# Altium project ieevs.PrjPcb
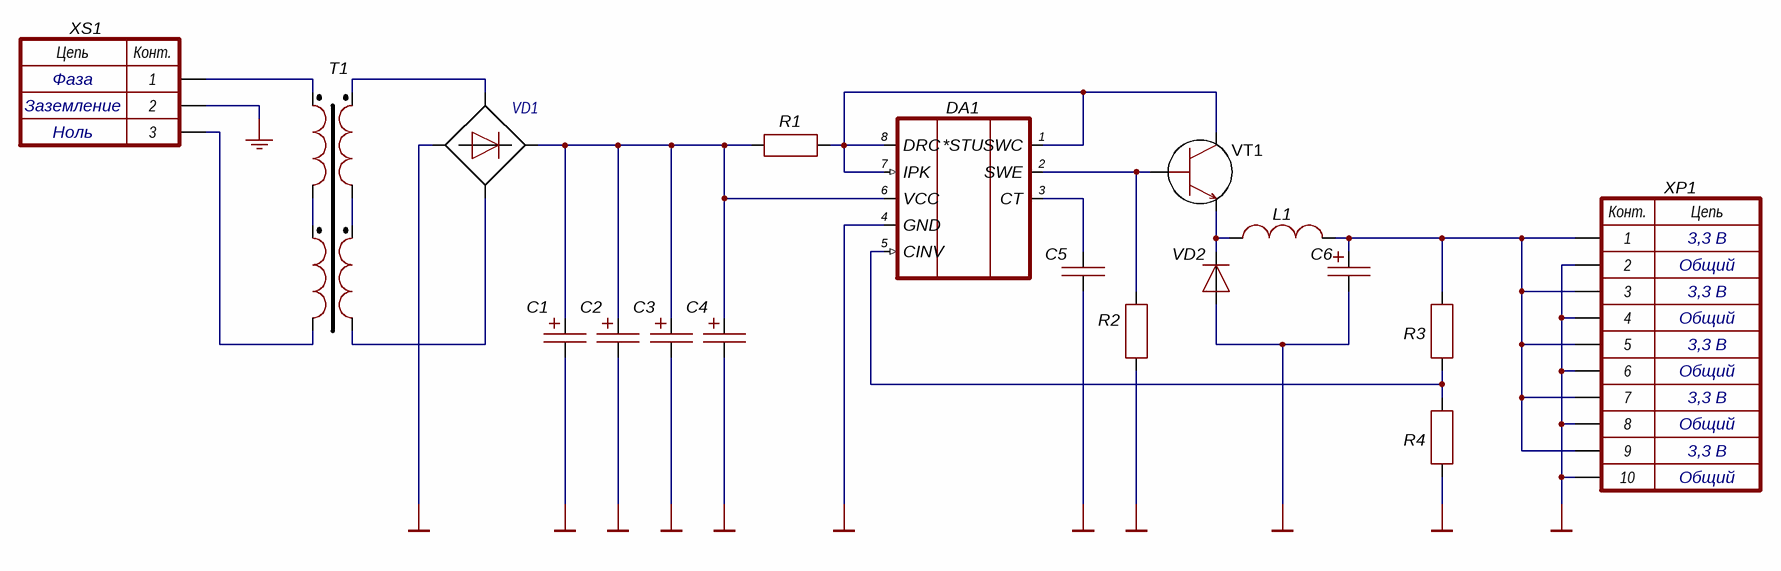
[diagram p0: principal.SchDoc]
1 sheet, 18 parts. Net scope: global (net labels, ports and power ports of the same name join across sheets).

## Sheet principal.SchDoc
size 420 x 297 mm

### Parts
C1  C_POL  [C_SMD_Al_G]  (value not drawn)
C2  C_POL  [C_SMD_Al_G]  (value not drawn)
C3  C_POL  [C_SMD_Al_G]  (value not drawn)
C4  C_POL  [C_SMD_Al_G]  (value not drawn)
C5  C  [C_1206]  (value not drawn)
C6  C_POL  [C_SMD_Al_G]  (value not drawn)
DA1  MC34063  [SO8]  (value not drawn)
L1  L  [IND_HTTI-220-3.0]  (value not drawn)
R1  R  [R_1206]  (value not drawn)
R2  R  [R_1206]  (value not drawn)
R3  R  [R_1206]  (value not drawn)
R4  R  [R_1206]  (value not drawn)
T1  T1-6_12-10  [TRANSFORMER_FS24-1500]  (value not drawn)
VD1  DB201S  [DIOB_DB107S]  (value not drawn)
VD2  VD  [SOD123]  (value not drawn)
VT1  NPN_BEC  [TO229P990X238-3N]  (value not drawn)
XP1  X_10  [PLS-10]  (value not drawn)
XS1  X_3  [PCBComponent_1]  (value not drawn)

### Nets
EARTH: XS1.2
GND: C1.1 C2.1 C3.1 C4.1 C5.1 C6.1 DA1.4(GND) R2.1 R4.1 VD1.NEG(A) VD2.1(A) XP1.2 XP1.4 XP1.6 XP1.8 XP1.10
NetC1_2: C1.2 C2.2 C3.2 C4.2 DA1.6(VCC) R1.2 VD1.POS(C)
NetC5_2: C5.2 DA1.3(CT)
NetC6_2: C6.2 L1.2 R3.2 XP1.1 XP1.3 XP1.5 XP1.7 XP1.9
NetDA1_1: DA1.1(SWC) DA1.7(IPK) DA1.8(DRC) R1.1 VT1.3(c)
NetDA1_2: DA1.2(SWE) R2.2 VT1.1(b)
NetDA1_5: DA1.5(CINV) R3.1 R4.2
NetL1_1: L1.1 VD2.2(C) VT1.2(e)
NetT1_1: T1.1 XS1.3
NetT1_2: T1.2 T1.3
NetT1_4: T1.4 XS1.1
NetT1_5: T1.5 VD1.1(B)
NetT1_6: T1.6 T1.7
NetT1_8: T1.8 VD1.2(D)

### Notes on the sheet
- Фаза
- Заземление
- Ноль
- 3,3 В
- Общий
- Перв. примен.
- Справ. №
- Подп. и дата
- Инв. № дубл.
- Взам. инв. №
- Разраб.
- Изм.
- Лист
- № докум.
- Подп.
- Дата
- Лит.
- Масса
- Масштаб
- Пров.
- Т. контр.
- Листов
- Инв. № подл.
- Н. контр.
- Утв.
- Копировал
- Формат А3
- (in symbol MC34063) *STU
- (in symbol X_3) Цепь; Конт.
- (in symbol X_10) Конт.; Цепь